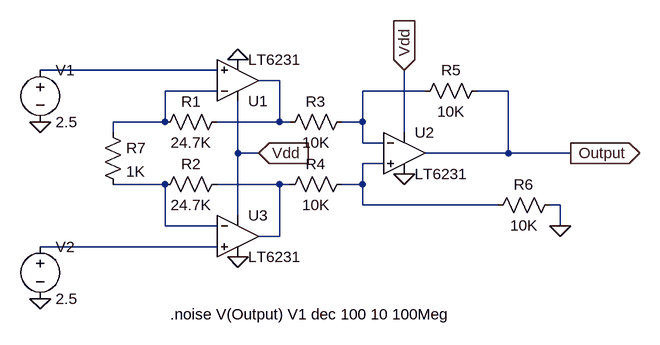
[diagram p0: schematic Instrumentation Amplifier noise simulation.asc]
Instrumentation Amplifier noise simulation.asc, the LTspice schematic file:
Version 4
SHEET 1 888 680
WIRE 208 160 -64 160
WIRE 304 176 272 176
WIRE 208 192 128 192
WIRE 528 192 432 192
WIRE 656 192 608 192
WIRE 128 240 128 192
WIRE 128 240 48 240
WIRE 304 240 304 176
WIRE 304 240 208 240
WIRE 320 240 304 240
WIRE 432 240 432 192
WIRE 432 240 400 240
WIRE 48 256 48 240
WIRE 496 256 496 160
WIRE 432 272 432 240
WIRE 464 272 432 272
WIRE 240 288 240 208
WIRE 272 288 240 288
WIRE 656 288 656 192
WIRE 656 288 528 288
WIRE 752 288 656 288
WIRE 464 304 432 304
WIRE 128 336 48 336
WIRE 304 336 208 336
WIRE 320 336 304 336
WIRE 432 336 432 304
WIRE 432 336 400 336
WIRE 432 368 432 336
WIRE 640 368 432 368
WIRE 736 368 720 368
WIRE 240 384 240 288
WIRE 128 400 128 336
WIRE 208 400 128 400
WIRE 736 400 736 368
WIRE 304 416 304 336
WIRE 304 416 272 416
WIRE 208 432 -64 432
FLAG 752 288 Output
IOPIN 752 288 Out
FLAG 240 144 0
FLAG 496 320 0
FLAG 240 448 0
FLAG 736 400 0
FLAG 496 160 Vdd
IOPIN 496 160 In
FLAG 272 288 Vdd
IOPIN 272 288 In
FLAG -64 512 0
FLAG -64 240 0
SYMBOL res 224 224 R90
WINDOW 0 0 56 VBottom 2
WINDOW 3 32 56 VTop 2
SYMATTR InstName R1
SYMATTR Value 24.7K
SYMBOL res 224 320 R90
WINDOW 0 0 56 VBottom 2
WINDOW 3 32 56 VTop 2
SYMATTR InstName R2
SYMATTR Value 24.7K
SYMBOL res 416 224 R90
WINDOW 0 0 56 VBottom 2
WINDOW 3 32 56 VTop 2
SYMATTR InstName R3
SYMATTR Value 10K
SYMBOL res 416 320 R90
WINDOW 0 0 56 VBottom 2
WINDOW 3 32 56 VTop 2
SYMATTR InstName R4
SYMATTR Value 10K
SYMBOL res 624 176 R90
WINDOW 0 0 56 VBottom 2
WINDOW 3 32 56 VTop 2
SYMATTR InstName R5
SYMATTR Value 10K
SYMBOL res 736 352 R90
WINDOW 0 0 56 VBottom 2
WINDOW 3 32 56 VTop 2
SYMATTR InstName R6
SYMATTR Value 10K
SYMBOL res 32 240 R0
SYMATTR InstName R7
SYMATTR Value 1K
SYMBOL LT6231 240 176 M180
SYMATTR InstName U1
SYMBOL LT6231 496 288 R0
SYMATTR InstName U2
SYMBOL LT6231 240 416 R0
SYMATTR InstName U3
SYMBOL voltage -64 144 R0
SYMATTR InstName V1
SYMATTR Value 2.5
SYMATTR Value2 AC 1 0
SYMATTR SpiceLine Rser=50
SYMBOL voltage -64 416 R0
SYMATTR InstName V2
SYMATTR Value 2.5
SYMATTR SpiceLine Rser=50
TEXT 136 536 Left 2 !.noise V(Output) V1 dec 100 10 100Meg

The netlist it stands for:
* Instrumentation Amplifier noise simulation.asc
R1 N002 N003 24.7K
R2 N007 N006 24.7K
R3 N004 N002 10K
R4 N005 N007 10K
R5 Output N004 10K
R6 0 N005 10K
R7 N003 N006 1K
XU1 N001 N003 N002 Vdd 0 LT6231  ; pins In+ In- OUT V+ V-
XU2 N005 N004 Output Vdd 0 LT6231  ; pins In+ In- OUT V+ V-
XU3 N008 N006 N007 Vdd 0 LT6231  ; pins In+ In- OUT V+ V-
V1 N001 0 2.5 AC 1 0 Rser=50
V2 N008 0 2.5 Rser=50
.noise V(Output) V1 dec 100 10 100Meg
.lib LTC2.lib
.backanno
.end